# Altium schematic sheet Acondicionamiento de la señal.SchDoc
size A4; SheetNumber: 5
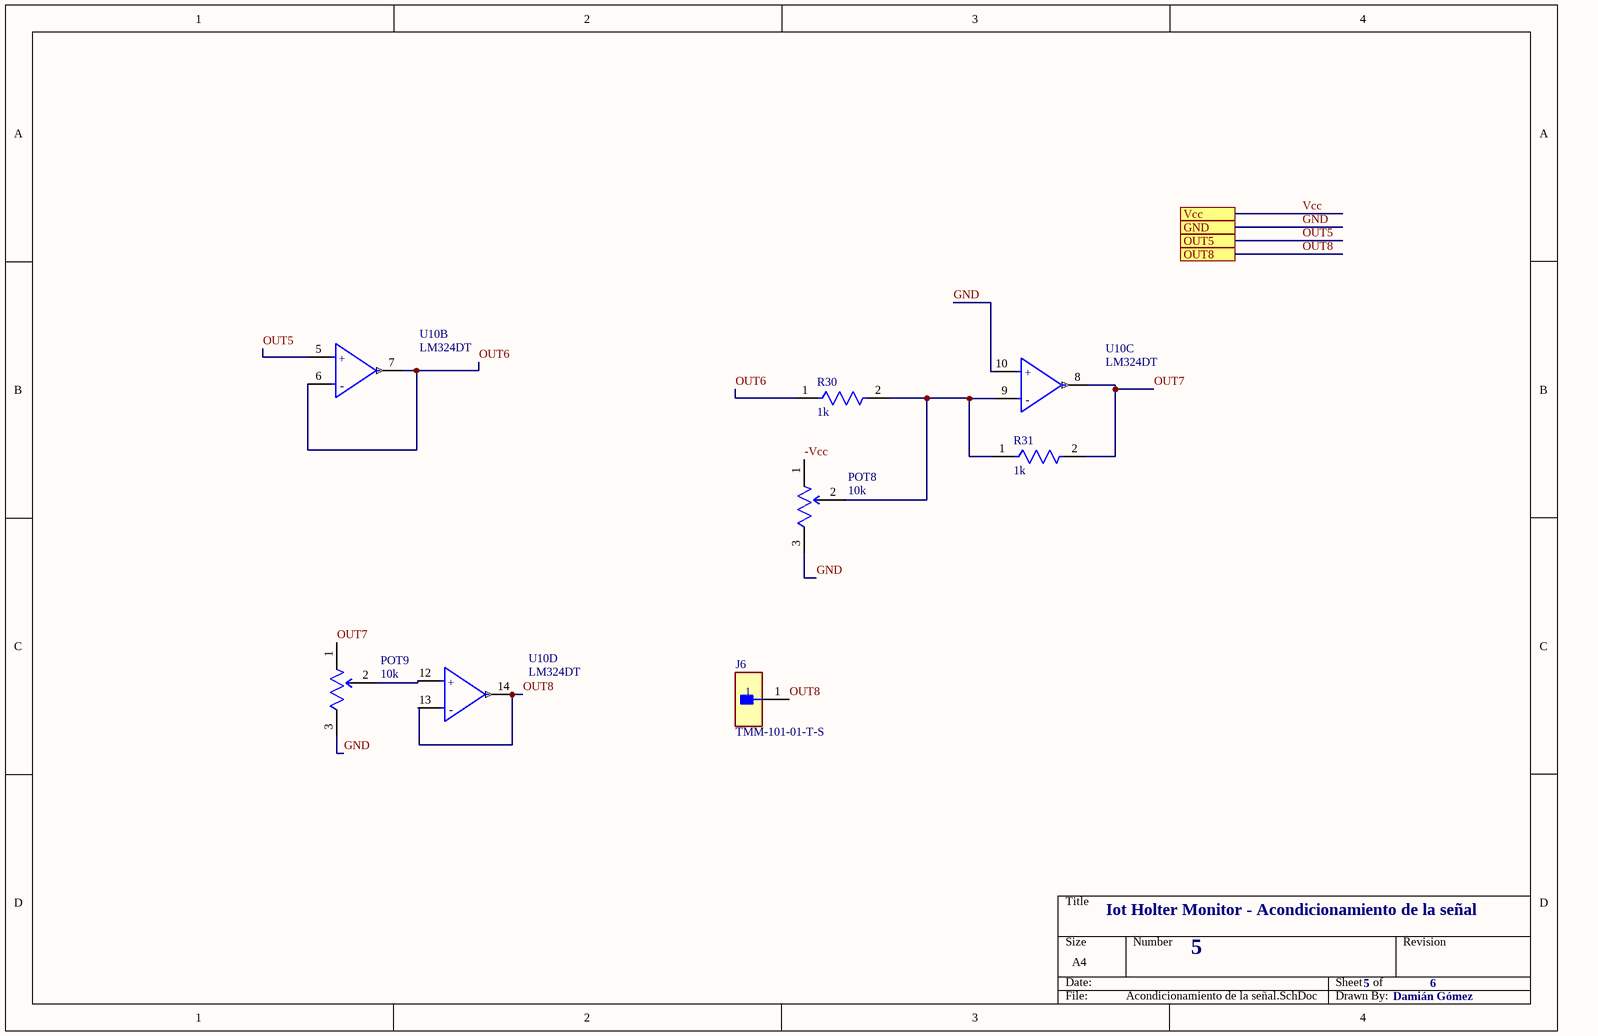
[diagram p0: Acondicionamiento de la señal.SchDoc]

## Parts
J6  TMM-101-01-T-S  [FP-TMM-101-01-T-S-MFG]
POT8  10k  [FP-3296W-MFG]
POT9  10k  [FP-3296W-MFG]
R30  1k  [FP-RC3216-MFG]
R31  1k  [FP-RC3216-MFG]
U10  LM324DT  [FP-SO-14-MFG]  (parts B,C,D of 4)

## Ports
GND, OUT5, OUT8, Vcc

## Nets
-Vcc: POT8.1(CCW)
GND: POT8.3(CW) POT9.3(CW) U10.10(Non-Inverting_Input_3) ; port GND
OUT5: U10.5(Non-Inverting_Input_2) ; port OUT5
OUT6: R30.1 U10.6(Inverting_Input_2) U10.7(Output_2)
OUT7: POT9.1(CCW) R31.2 U10.8(Output_3)
OUT8: J6.1 U10.13(Inverting_Input_4) U10.14(Output_4) ; port OUT8
Vcc: port Vcc
NetPOT8_2: POT8.2(WIPER) R30.2 R31.1 U10.9(Inverting_Input_3)
NetPOT9_2: POT9.2(WIPER) U10.12(Non-Inverting_Input_4)

## Notes on the sheet
- Iot Holter Monitor - Acondicionamiento de la señal
- 5
- 6
- Damián Gómez
- (in symbol CMP-12131-000005-1, part B) +; -
- (in symbol CMP-12131-000005-1, part C) +; -
- (in symbol CMP-12131-000005-1, part D) +; -

## Library data of the parts
J6 = CMP-02766-001504-1: CONN HEADER VERT 1POS; Number of Positions: 1; Gender: Male; Lead Free: Lead Free; Contact Plating: Tin; Insulation Color: Black; Max Operating Temperature: 105°C; Connector Type: Header; Radiation Hardening: No; Packaging: Bulk; Contact Material: Bronze; Contact Shape: Square; Min Operating Temperature: -55°C; Contact Type: Male Pin; Insulation Material: Polymer; Series: TMM; Contact Finish - Mating: TIN; Fastening Type: Pull; Number of Rows: 1; Number of Contacts: 1; REACH SVHC: No SVHC; Mount: Through Hole; Termination: Solder
POT8 POT9 = CMP-07234-000024-1: TRIMMER 10K OHM 0.5W PC PIN TOP; Resistance: 10kR; Temperature Coefficient: 100ppm/°C; Power Rating: 500mW; Tolerance: 10%; Number of Turns: 25; Width: 0.19inch; Termination: Pin; Radiation Hardening: No; Contact Plating: Tin; Composition: Cermet; Length: 9.53mm; Height: 0.395inch; Depth: 4.83mm; REACH SVHC: No SVHC; Weight: 0.03oz; Min Operating Temperature: -55°C; Military Standard: Not; Max Operating Temperature: 125°C; Packaging: Tape and Reel; Package Quantity: 1; Taper: Linear; Max Power Dissipation: 500mW; Mount: Through Hole
R30 R31 = CMP-13261-001932-1: Res Thick Film 1206 1kΩ 5% 0.25W ±100ppm/°C Molded SMD T/R; Max Power Dissipation: 250mW; Resistance: 1kR; Voltage Rating (DC): 200V; Width: 0.063inch; Length: 0.126inch; Min Operating Temperature: -55°C; Packaging: Tape and Reel; Case Code (Metric): 3216; Contact Plating: Tin; Composition: Thick Film; Military Standard: Not; Depth: 1.6mm; Lead Free: Lead Free; Height: 0.026inch; Case Code (Imperial): 1206; Number of Terminations: 2; Radiation Hardening: No; Case/Package: 1206; Features: Moisture Resistant; Power Rating: 250mW; Max Operating Temperature: 155°C; Tolerance: 5%; Temperature Coefficient: 100ppm/°C
U10 = CMP-12131-000005-1: IC OPAMP GP 4 CIRCUIT 14SO; Manufacturer: STMicroelectronics; Voltage Gain: 100dB; Standoff Height: 0.1mm; Bandwidth: 1.3MHz; Max Junction Temp: +150°C; Min Supply Voltage: 3V; Max Dual Supply Voltage: 15V; Min Dual Supply Voltage: 1.5V; Number Of Channels: 4; Nominal Supply Current: 0.7-1.5mA; Output Current Per Channel: 20-50mA; Max Supply Voltage: 30V; Input Offset Voltage: 2mV; Input Bias Current: 0.02uA; Device Class L1: Integrated Circuits (ICs); Device Class L3: Amplifiers - Op Amps; Temperature Range Low: 0°C; Package: SO-14; Temperature Range High: +70°C; Digikey Description: IC OPAMP GP 4 CIRCUIT 14SO; Device Class L2: Linear ICs; Footprint Url: https://www.st.com/content/ccc/resource/technical/document/datasheet/group3/10/8a/e6/12/f8/e8/49/ce/DM00366438/files/DM00366438.pdf/jcr:content/translations/en.DM00366438.pdf; Octopart: https://octopart.com/lm324dt-stmicroelectronics-39579146; ComponentLink2URL: https://www.st.com/content/ccc/resource/technical/document/datasheet/bd/fc/46/43/26/8f/40/7f/CD00001046.pdf/files/CD00001046.pdf/jcr:content/translations/en.CD00001046.pdf; ComponentLink2Description: Datasheet; Lead Free: Yes; Temperature: 0°C to +70°C; RoHS: TRUE; Gain Bandwidth: 1.3MHz; Manufacturer Part Number: LM324DT; Automotive: No; Category: IC; Height: 1.75mm; Mouser Description: LM324 Series 32 V 1.3 MHz Low Power Quad Operational Amplifier - SOIC-14